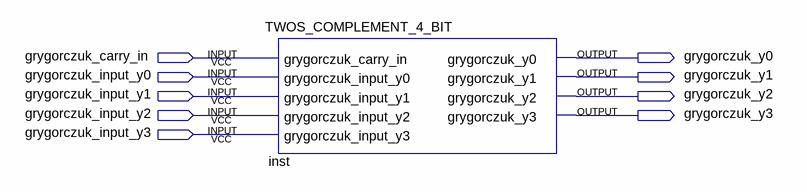
[diagram p0: schematic sheet]
// Quartus schematic TWOS_COMPLEMENT_SYMBOL_4_BIT.bdf as structural Verilog: 1 symbols, 9 pins
module TWOS_COMPLEMENT_SYMBOL_4_BIT (
  input  grygorczuk_carry_in,
  input  grygorczuk_input_y0,
  input  grygorczuk_input_y1,
  input  grygorczuk_input_y2,
  input  grygorczuk_input_y3,
  output grygorczuk_y0,
  output grygorczuk_y1,
  output grygorczuk_y2,
  output grygorczuk_y3
);

  TWOS_COMPLEMENT_4_BIT inst (
    .grygorczuk_carry_in(grygorczuk_carry_in), .grygorczuk_input_y0(grygorczuk_input_y0),
    .grygorczuk_input_y1(grygorczuk_input_y1), .grygorczuk_input_y2(grygorczuk_input_y2),
    .grygorczuk_input_y3(grygorczuk_input_y3), .grygorczuk_y0(grygorczuk_y0), .grygorczuk_y1(grygorczuk_y1),
    .grygorczuk_y2(grygorczuk_y2), .grygorczuk_y3(grygorczuk_y3));
endmodule
